# EAGLE design untitled (EAGLE 8.3.2)
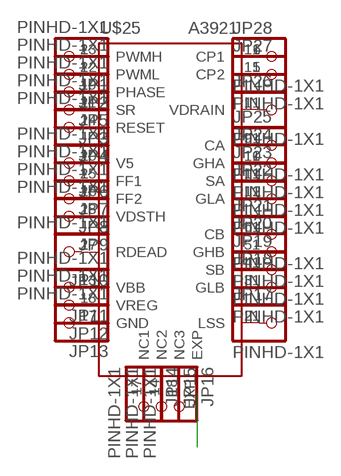
[diagram p0: schematic, sheet 1]

## Parts
JP1  PINHD-1X1  [1X01]
JP2  PINHD-1X1  [1X01]
JP3  PINHD-1X1  [1X01]
JP4  PINHD-1X1  [1X01]
JP5  PINHD-1X1  [1X01]
JP6  PINHD-1X1  [1X01]
JP7  PINHD-1X1  [1X01]
JP8  PINHD-1X1  [1X01]
JP9  PINHD-1X1  [1X01]
JP10  PINHD-1X1  [1X01]
JP11  PINHD-1X1  [1X01]
JP12  PINHD-1X1  [1X01]
JP13  PINHD-1X1  [1X01]
JP14  PINHD-1X1  [1X01]
JP15  PINHD-1X1  [1X01]
JP16  PINHD-1X1  [1X01]
JP17  PINHD-1X1  [1X01]
JP18  PINHD-1X1  [1X01]
JP19  PINHD-1X1  [1X01]
JP20  PINHD-1X1  [1X01]
JP21  PINHD-1X1  [1X01]
JP22  PINHD-1X1  [1X01]
JP23  PINHD-1X1  [1X01]
JP24  PINHD-1X1  [1X01]
JP25  PINHD-1X1  [1X01]
JP26  PINHD-1X1  [1X01]
JP27  PINHD-1X1  [1X01]
JP28  PINHD-1X1  [1X01]
U$25  A3921  [TSSOP28]

## Nets
GND: JP13.1 U$25.17(GND)
N$1: JP2.1 U$25.22(PWML)
N$2: JP1.1 U$25.23(PWMH)
N$3: U$25.EXP
N$4: JP3.1 U$25.21(SR)
N$5: JP4.1 U$25.24(RESET)
N$7: JP5.1 U$25.19(PHASE)
N$8: JP6.1 U$25.20(V5)
N$9: JP7.1 U$25.25(FF1)
N$10: JP8.1 U$25.26(FF2)
N$11: JP9.1 U$25.28(VDSTH)
N$14: JP10.1 U$25.27(RDEAD)
N$15: JP12.1 U$25.8(VREG)
N$16: JP14.1 U$25.7(NC1)
N$17: JP15.1 U$25.14(NC2)
N$18: JP16.1 U$25.18(NC3)
N$20: JP17.1 U$25.2(LSS)
N$21: JP18.1 U$25.3(GLB)
N$22: JP21.1 U$25.6(CB)
N$23: JP22.1 U$25.12(GLA)
N$24: JP23.1 U$25.11(SA)
N$25: JP24.1 U$25.10(GHA)
N$26: JP25.1 U$25.9(CA)
N$27: JP27.1 U$25.15(CP2)
N$28: JP28.1 U$25.16(CP1)
N$29: JP20.1 U$25.5(GHB)
N$30: JP19.1 U$25.4(SB)
VBB: JP11.1 U$25.13(VBB)
VDRAIN: JP26.1 U$25.1(VDRAIN)

## Library data of the parts
JP1-JP28 = !pinhead(ﾋﾟﾝﾍｯﾀﾞ):PINHD-1X1: PIN HEADER
U$25 = !irs(GateDriver):A3921

## Board
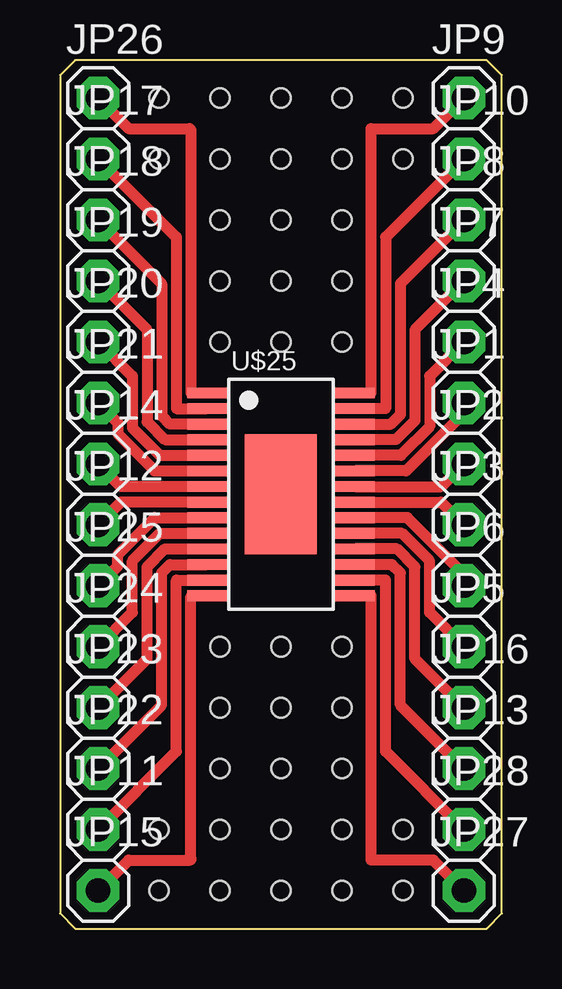
[diagram p1: board, top side]

Size 18.41 x 36.2 mm. Coordinates in mm from the lower left corner, seen from the top.
Outline: 0,35.56 0,0.63 0.64,0 17.78,0 18.41,0.63 18.41,35.56 17.78,36.2 0.64,36.2 0,35.56
Copper layers (1*16): Top 0.035mm / dielectric 1.6mm / Bottom 0.035mm
Design rules "Elecrow_2-layer_PCB_eagle_rule *": minimum track width 6mil, minimum drill 12mil, track to track 6mil, track to pad 6mil, pad to pad 6mil, via to via 8mil, smd to smd 0mil, copper to edge 20mil, drill to drill 10mil, minimum pad ring 6mil, minimum via ring 6mil, stop-mask expansion 0mil, vias tented up to drill 100mil, thermal gap 10mil
Holes 0.8 mm at 4.13,34.61 6.67,34.61 9.21,34.61 11.75,34.61 14.29,34.61 11.75,32.07 6.67,32.07 9.21,32.07 6.67,29.53 9.21,29.53 11.75,29.53 11.75,26.99 9.21,26.99 6.67,26.99 6.67,24.45 9.21,24.45 11.75,24.45 6.67,11.75 9.21,11.75 11.75,11.75 11.75,9.21 9.21,9.21 6.67,9.21 6.67,6.67 11.75,6.67 9.21,6.67 6.67,4.13 9.21,4.13 11.75,4.13 14.29,1.59 11.75,1.59 9.21,1.59 6.67,1.59 4.13,1.59 4.13,4.13 14.29,4.13 14.29,32.07 4.13,32.07

### Footprints (pad centres in the part's own frame; a part is rotated, then mirrored left to right if it is on the bottom)
1X01 = drill 1.016 pad 1.778 octagon: 1 0,0
TSSOP28 = smd 0.45 x 1.65: 1 -4.225,-3.087; 2 -3.575,-3.087; 3 -2.925,-3.087; 4 -2.275,-3.087; 5 -1.625,-3.087; 6 -0.975,-3.087; 7 -0.325,-3.087; 8 0.325,-3.087; 9 0.975,-3.087; 10 1.625,-3.087; 11 2.275,-3.087; 12 2.925,-3.087; 13 3.575,-3.087; 14 4.225,-3.087; 15 4.225,3.087; 16 3.575,3.087; 17 2.925,3.087; 18 2.275,3.087; 19 1.625,3.087; 20 0.975,3.087; 21 0.325,3.087; 22 -0.325,3.087; 23 -0.975,3.087; 24 -1.625,3.087; 25 -2.275,3.087; 26 -2.925,3.087; 27 -3.575,3.087; 28 -4.225,3.087 | smd 5 x 3: EXP 0,0

### Placement (x,y rotation side)
JP1  16.83,21.91 0 top
JP2  16.83,19.37 0 top
JP3  16.83,16.83 0 top
JP4  16.83,24.45 0 top
JP5  16.83,11.75 0 top
JP6  16.83,14.29 0 top
JP7  16.83,26.99 0 top
JP8  16.83,29.53 0 top
JP9  16.83,34.61 0 top
JP10  16.83,32.07 0 top
JP11  1.59,4.13 0 top
JP12  1.59,16.83 0 top
JP13  16.83,6.67 0 top
JP14  1.59,19.37 0 top
JP15  1.59,1.59 0 top
JP16  16.83,9.21 0 top
JP17  1.59,32.07 0 top
JP18  1.59,29.53 0 top
JP19  1.59,26.99 0 top
JP20  1.59,24.45 0 top
JP21  1.59,21.91 0 top
JP22  1.59,6.67 0 top
JP23  1.59,9.21 0 top
JP24  1.59,11.75 0 top
JP25  1.59,14.29 0 top
JP26  1.59,34.61 0 top
JP27  16.83,1.59 0 top
JP28  16.83,4.13 0 top
U$25  9.21,18.1 270 top

### Tracks (layer width: path | path; a pad name or v marks a point on that pad's centre or on a via)
GND
  Top 0.457: U$25.17 13.83,15.17 14.18,14.83 14.18,9.32 JP13.1
N$1
  Top 0.457: U$25.22 15.88,18.42 JP2.1
N$2
  Top 0.457: JP1.1 16.83,21.48 14.42,19.07 U$25.23
N$4
  Top 0.457: U$25.21 15.88,17.77 JP3.1
N$5
  Top 0.457: U$25.24 14.21,19.72 15.4,20.91 15.4,23.02 JP4.1
N$7
  Top 0.457: JP5.1 15.4,13.18 15.4,15.33 14.26,16.47 U$25.19
N$8
  Top 0.457: JP6.1 16.83,14.76 14.47,17.12 U$25.20
N$9
  Top 0.457: JP7.1 14.79,24.95 14.79,21.17 13.99,20.37 U$25.25
N$10
  Top 0.457: U$25.26 13.78,21.02 14.18,21.42 14.18,26.88 JP8.1
N$11
  Top 0.457: U$25.28 12.96,22.32 12.96,33.34 15.56,33.34 JP9.1
N$14
  Top 0.457: U$25.27 13.57,21.67 13.57,28.81 JP10.1
N$15
  Top 0.457: U$25.8 2.53,17.77 JP12.1
N$16
  Top 0.457: U$25.7 2.53,18.42 JP14.1
N$17
  Top 0.457: U$25.14 5.48,13.87 5.45,13.84 5.45,2.91 arc-90 5.4,2.86 2.86,2.86 JP15.1
N$18
  Top 0.457: JP16.1 14.79,11.25 14.79,15.08 14.04,15.82 U$25.18
N$20
  Top 0.457: U$25.2 4.85,21.67 4.85,28.81 JP17.1 2.14,31.51
N$21
  Top 0.457: U$25.3 4.58,21.02 4.24,21.37 4.24,26.88 JP18.1
N$22
  Top 0.457: JP21.1 2.41,21.09 2.41,20.61 3.95,19.07 U$25.6
N$23
  Top 0.457: U$25.12 4.58,15.17 4.24,14.83 4.24,9.32 JP22.1
N$24
  Top 0.457: JP23.1 3.63,11.25 3.63,15.08 4.37,15.82 U$25.11
N$25
  Top 0.457: JP24.1 3.02,13.18 3.02,15.33 4.16,16.47 U$25.10
N$26
  Top 0.457: JP25.1 2.41,15.11 2.41,15.58 3.95,17.12 U$25.9
N$27
  Top 0.457: U$25.15 12.96,13.87 12.96,2.86 15.56,2.86 JP27.1
N$28
  Top 0.457: U$25.16 13.57,14.52 13.57,7.39 JP28.1
N$29
  Top 0.457: JP20.1 3.02,23.02 3.02,20.86 4.16,19.72 U$25.5
N$30
  Top 0.457: JP19.1 3.63,24.95 3.63,21.12 4.37,20.37 U$25.4
VBB
  Top 0.457: U$25.13 4.85,14.52 4.85,7.39 JP11.1
VDRAIN
  Top 0.457: U$25.1 5.45,22.32 5.45,33.28 5.4,33.34 2.86,33.34 JP26.1